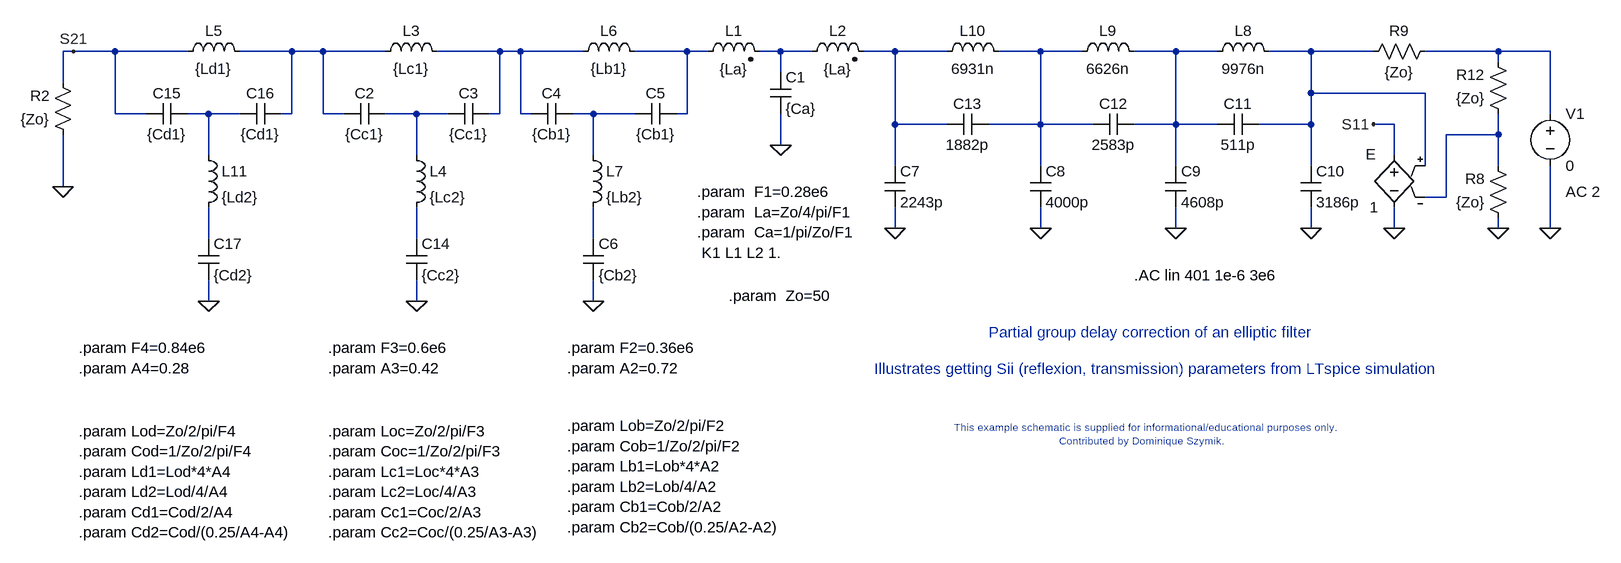
[diagram p0: schematic elip_grd.asc]
elip_grd.asc, the LTspice schematic file:
Version 4
SHEET 1 1864 1056
WIRE -912 240 -928 240
WIRE -848 240 -912 240
WIRE -736 240 -848 240
WIRE -576 240 -656 240
WIRE -528 240 -576 240
WIRE -432 240 -528 240
WIRE -256 240 -352 240
WIRE -224 240 -256 240
WIRE -128 240 -224 240
WIRE 32 240 -48 240
WIRE 64 240 32 240
WIRE 176 240 144 240
WIRE 224 240 176 240
WIRE 352 240 304 240
WIRE 432 240 352 240
WIRE 576 240 512 240
WIRE 640 240 576 240
WIRE 784 240 720 240
WIRE 848 240 784 240
WIRE 992 240 928 240
WIRE 1088 240 992 240
WIRE 1280 240 1168 240
WIRE 1360 240 1280 240
WIRE 1280 256 1280 240
WIRE 176 272 176 240
WIRE -928 288 -928 240
WIRE 992 304 992 240
WIRE 1168 304 992 304
WIRE -848 336 -848 240
WIRE -800 336 -848 336
WIRE -704 336 -736 336
WIRE -656 336 -704 336
WIRE -576 336 -576 240
WIRE -576 336 -592 336
WIRE -528 336 -528 240
WIRE -496 336 -528 336
WIRE -384 336 -432 336
WIRE -336 336 -384 336
WIRE -256 336 -256 240
WIRE -256 336 -272 336
WIRE -224 336 -224 240
WIRE -208 336 -224 336
WIRE -112 336 -144 336
WIRE -48 336 -112 336
WIRE 32 336 32 240
WIRE 32 336 16 336
WIRE 1360 336 1360 240
WIRE 352 352 352 240
WIRE 432 352 352 352
WIRE 576 352 576 240
WIRE 576 352 496 352
WIRE 656 352 576 352
WIRE 784 352 784 240
WIRE 784 352 720 352
WIRE 848 352 784 352
WIRE 992 352 992 304
WIRE 992 352 912 352
WIRE 1120 352 1088 352
WIRE 1280 368 1280 336
WIRE 1280 368 1200 368
WIRE 176 384 176 336
WIRE -704 400 -704 336
WIRE -384 400 -384 336
WIRE -112 400 -112 336
WIRE 1120 400 1120 352
WIRE 352 416 352 352
WIRE 576 416 576 352
WIRE 784 416 784 352
WIRE 992 416 992 352
WIRE 1168 416 1168 304
WIRE 1280 416 1280 368
WIRE -928 448 -928 368
WIRE 1200 464 1200 368
WIRE 1200 464 1168 464
WIRE 352 512 352 480
WIRE 576 512 576 480
WIRE 784 512 784 480
WIRE 992 512 992 480
WIRE 1120 512 1120 480
WIRE 1280 512 1280 496
WIRE 1360 512 1360 416
WIRE -704 528 -704 480
WIRE -384 528 -384 480
WIRE -112 528 -112 480
WIRE -704 624 -704 592
WIRE -384 624 -384 592
WIRE -112 624 -112 592
FLAG 1280 512 0
FLAG 176 384 0
FLAG -928 448 0
FLAG -112 624 0
FLAG 352 512 0
FLAG 576 512 0
FLAG 784 512 0
FLAG 992 512 0
FLAG 1360 512 0
FLAG 1120 512 0
FLAG -384 624 0
FLAG -704 624 0
FLAG -912 240 S21
FLAG 1088 352 S11
SYMBOL ind2 48 256 R270
WINDOW 0 32 56 VTop 2
WINDOW 3 4 56 VBottom 2
SYMATTR InstName L1
SYMATTR Value {La}
SYMBOL cap 160 272 R0
SYMATTR InstName C1
SYMATTR Value {Ca}
SYMBOL RES -912 384 R180
WINDOW 0 36 76 Left 2
WINDOW 3 36 40 Left 2
SYMATTR InstName R2
SYMATTR Value {Zo}
SYMBOL VOLTAGE 1360 320 R0
WINDOW 39 0 0 Left 2
WINDOW 123 24 136 Left 2
SYMATTR Value2 AC 2
SYMATTR InstName V1
SYMATTR Value 0
SYMBOL ind2 208 256 R270
WINDOW 0 32 56 VTop 2
WINDOW 3 4 56 VBottom 2
SYMATTR InstName L2
SYMATTR Value {La}
SYMBOL ind -144 256 R270
WINDOW 0 32 56 VTop 2
WINDOW 3 5 56 VBottom 2
SYMATTR InstName L6
SYMATTR Value {Lb1}
SYMBOL ind -128 384 R0
SYMATTR InstName L7
SYMATTR Value {Lb2}
SYMBOL cap -144 320 R90
WINDOW 0 0 32 VBottom 2
WINDOW 3 32 32 VTop 2
SYMATTR InstName C4
SYMATTR Value {Cb1}
SYMBOL cap 16 320 R90
WINDOW 0 0 32 VBottom 2
WINDOW 3 32 32 VTop 2
SYMATTR InstName C5
SYMATTR Value {Cb1}
SYMBOL cap -128 528 R0
SYMATTR InstName C6
SYMATTR Value {Cb2}
SYMBOL ind 832 256 R270
WINDOW 0 32 56 VTop 2
WINDOW 3 5 56 VBottom 2
SYMATTR InstName L8
SYMATTR Value 9976n
SYMBOL ind 624 256 R270
WINDOW 0 32 56 VTop 2
WINDOW 3 5 56 VBottom 2
SYMATTR InstName L9
SYMATTR Value 6626n
SYMBOL ind 416 256 R270
WINDOW 0 32 56 VTop 2
WINDOW 3 5 56 VBottom 2
SYMATTR InstName L10
SYMATTR Value 6931n
SYMBOL cap 336 416 R0
SYMATTR InstName C7
SYMATTR Value 2243p
SYMBOL cap 560 416 R0
SYMATTR InstName C8
SYMATTR Value 4000p
SYMBOL cap 768 416 R0
SYMATTR InstName C9
SYMATTR Value 4608p
SYMBOL cap 976 416 R0
SYMATTR InstName C10
SYMATTR Value 3186p
SYMBOL cap 912 336 R90
WINDOW 0 0 32 VBottom 2
WINDOW 3 32 32 VTop 2
SYMATTR InstName C11
SYMATTR Value 511p
SYMBOL cap 720 336 R90
WINDOW 0 0 32 VBottom 2
WINDOW 3 32 32 VTop 2
SYMATTR InstName C12
SYMATTR Value 2583p
SYMBOL cap 496 336 R90
WINDOW 0 0 32 VBottom 2
WINDOW 3 32 32 VTop 2
SYMATTR InstName C13
SYMATTR Value 1882p
SYMBOL RES 1296 512 R180
WINDOW 0 36 76 Left 2
WINDOW 3 36 40 Left 2
SYMATTR InstName R8
SYMATTR Value {Zo}
SYMBOL res 1184 224 R90
WINDOW 0 0 56 VBottom 2
WINDOW 3 32 56 VTop 2
SYMATTR InstName R9
SYMATTR Value {Zo}
SYMBOL res 1296 352 R180
WINDOW 0 36 76 Left 2
WINDOW 3 36 40 Left 2
SYMATTR InstName R12
SYMATTR Value {Zo}
SYMBOL E 1120 384 M0
WINDOW 0 28 14 Left 2
SYMATTR InstName E
SYMATTR Value 1
SYMBOL ind -448 256 R270
WINDOW 0 32 56 VTop 2
WINDOW 3 5 56 VBottom 2
SYMATTR InstName L3
SYMATTR Value {Lc1}
SYMBOL ind -400 384 R0
SYMATTR InstName L4
SYMATTR Value {Lc2}
SYMBOL cap -432 320 R90
WINDOW 0 0 32 VBottom 2
WINDOW 3 32 32 VTop 2
SYMATTR InstName C2
SYMATTR Value {Cc1}
SYMBOL cap -272 320 R90
WINDOW 0 0 32 VBottom 2
WINDOW 3 32 32 VTop 2
SYMATTR InstName C3
SYMATTR Value {Cc1}
SYMBOL cap -400 528 R0
SYMATTR InstName C14
SYMATTR Value {Cc2}
SYMBOL ind -752 256 R270
WINDOW 0 32 56 VTop 2
WINDOW 3 5 56 VBottom 2
SYMATTR InstName L5
SYMATTR Value {Ld1}
SYMBOL ind -720 384 R0
SYMATTR InstName L11
SYMATTR Value {Ld2}
SYMBOL cap -736 320 R90
WINDOW 0 0 32 VBottom 2
WINDOW 3 32 32 VTop 2
SYMATTR InstName C15
SYMATTR Value {Cd1}
SYMBOL cap -592 320 R90
WINDOW 0 0 32 VBottom 2
WINDOW 3 32 32 VTop 2
SYMATTR InstName C16
SYMATTR Value {Cd1}
SYMBOL cap -720 528 R0
SYMATTR InstName C17
SYMATTR Value {Cd2}
TEXT 48 456 Left 2 !.param  F1=0.28e6 \n.param  La=Zo/4/pi/F1\n.param  Ca=1/pi/Zo/F1\n K1 L1 L2 1.
TEXT 720 584 Left 2 !.AC lin 401 1e-6 3e6
TEXT -152 816 Left 2 !.param Lob=Zo/2/pi/F2\n.param Cob=1/Zo/2/pi/F2\n.param Lb1=Lob*4*A2\n.param Lb2=Lob/4/A2\n.param Cb1=Cob/2/A2\n.param Cb2=Cob/(0.25/A2-A2)
TEXT -152 696 Left 2 !.param F2=0.36e6\n.param A2=0.72
TEXT -520 696 Left 2 !.param F3=0.6e6\n.param A3=0.42
TEXT -520 824 Left 2 !.param Loc=Zo/2/pi/F3\n.param Coc=1/Zo/2/pi/F3\n.param Lc1=Loc*4*A3\n.param Lc2=Loc/4/A3\n.param Cc1=Coc/2/A3\n.param Cc2=Coc/(0.25/A3-A3)
TEXT -904 696 Left 2 !.param F4=0.84e6\n.param A4=0.28
TEXT -904 824 Left 2 !.param Lod=Zo/2/pi/F4\n.param Cod=1/Zo/2/pi/F4\n.param Ld1=Lod*4*A4\n.param Ld2=Lod/4/A4\n.param Cd1=Cod/2/A4\n.param Cd2=Cod/(0.25/A4-A4)
TEXT 96 616 Left 2 !.param  Zo=50
TEXT 496 672 Left 2 ;Partial group delay correction of an elliptic filter
TEXT 320 728 Left 2 ;Illustrates getting Sii (reflexion, transmission) parameters from LTspice simulation
TEXT 728 808 Top 1 ;This example schematic is supplied for informational/educational purposes only.\nContributed by Dominique Szymik.

The netlist it stands for:
* elip_grd.asc
L1 N003 N004 {La}
C1 N004 0 {Ca}
R2 0 S21 {Zo}
V1 N009 0 0 AC 2
L2 N004 N005 {La}
L6 N002 N003 {Lb1}
L7 N012 N016 {Lb2}
C4 N012 N002 {Cb1}
C5 N003 N012 {Cb1}
C6 N016 0 {Cb2}
L8 N007 N008 9976n
L9 N006 N007 6626n
L10 N005 N006 6931n
C7 N005 0 2243p
C8 N006 0 4000p
C9 N007 0 4608p
C10 N008 0 3186p
C11 N008 N007 511p
C12 N007 N006 2583p
C13 N006 N005 1882p
R8 0 N013 {Zo}
R9 N009 N008 {Zo}
R12 N013 N009 {Zo}
E S11 0 N008 N013 1
L3 N001 N002 {Lc1}
L4 N011 N015 {Lc2}
C2 N011 N001 {Cc1}
C3 N002 N011 {Cc1}
C14 N015 0 {Cc2}
L5 S21 N001 {Ld1}
L11 N010 N014 {Ld2}
C15 N010 S21 {Cd1}
C16 N001 N010 {Cd1}
C17 N014 0 {Cd2}
.param  F1=0.28e6
.param  La=Zo/4/pi/F1
.param  Ca=1/pi/Zo/F1
 K1 L1 L2 1.
.AC lin 401 1e-6 3e6
.param Lob=Zo/2/pi/F2
.param Cob=1/Zo/2/pi/F2
.param Lb1=Lob*4*A2
.param Lb2=Lob/4/A2
.param Cb1=Cob/2/A2
.param Cb2=Cob/(0.25/A2-A2)
.param F2=0.36e6
.param A2=0.72
.param F3=0.6e6
.param A3=0.42
.param Loc=Zo/2/pi/F3
.param Coc=1/Zo/2/pi/F3
.param Lc1=Loc*4*A3
.param Lc2=Loc/4/A3
.param Cc1=Coc/2/A3
.param Cc2=Coc/(0.25/A3-A3)
.param F4=0.84e6
.param A4=0.28
.param Lod=Zo/2/pi/F4
.param Cod=1/Zo/2/pi/F4
.param Ld1=Lod*4*A4
.param Ld2=Lod/4/A4
.param Cd1=Cod/2/A4
.param Cd2=Cod/(0.25/A4-A4)
.param  Zo=50
* Partial group delay correction of an elliptic filter
* Illustrates getting Sii (reflexion, transmission) parameters from LTspice simulation
* This example schematic is supplied for informational/educational purposes only.
* Contributed by Dominique Szymik.
.backanno
.end